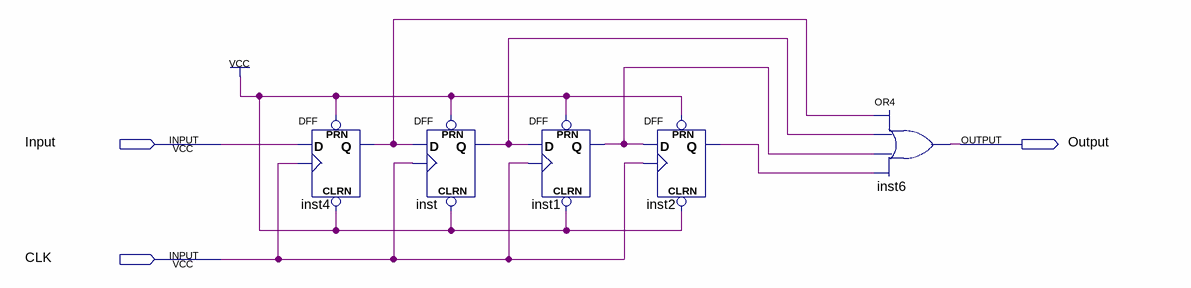
[diagram p0: schematic sheet]
// Quartus schematic debounce.bdf as structural Verilog: 5 symbols, 3 pins
module debounce (
  input  Input,
  input  CLK,
  output Output
);

  wire inst1_q, inst2_q, inst4_q, inst_q;

  DFF inst4 (.CLRN(1'b1), .CLK(CLK), .D(Input), .PRN(1'b1), .Q(inst4_q));
  DFF inst (.CLRN(1'b1), .CLK(CLK), .D(inst4_q), .PRN(1'b1), .Q(inst_q));
  DFF inst1 (.CLRN(1'b1), .CLK(CLK), .D(inst_q), .PRN(1'b1), .Q(inst1_q));
  DFF inst2 (.CLRN(1'b1), .CLK(CLK), .D(inst1_q), .PRN(1'b1), .Q(inst2_q));
  or inst6 (Output, inst4_q, inst_q, inst1_q, inst2_q);
endmodule
